# EasyEDA schematic Arduino StandAlone.json
TITLE: Arduino Standalone; REV: 1.0; Date: 2016-11-16; Sheet: 1/1; Drawn By: Wagner Rambo
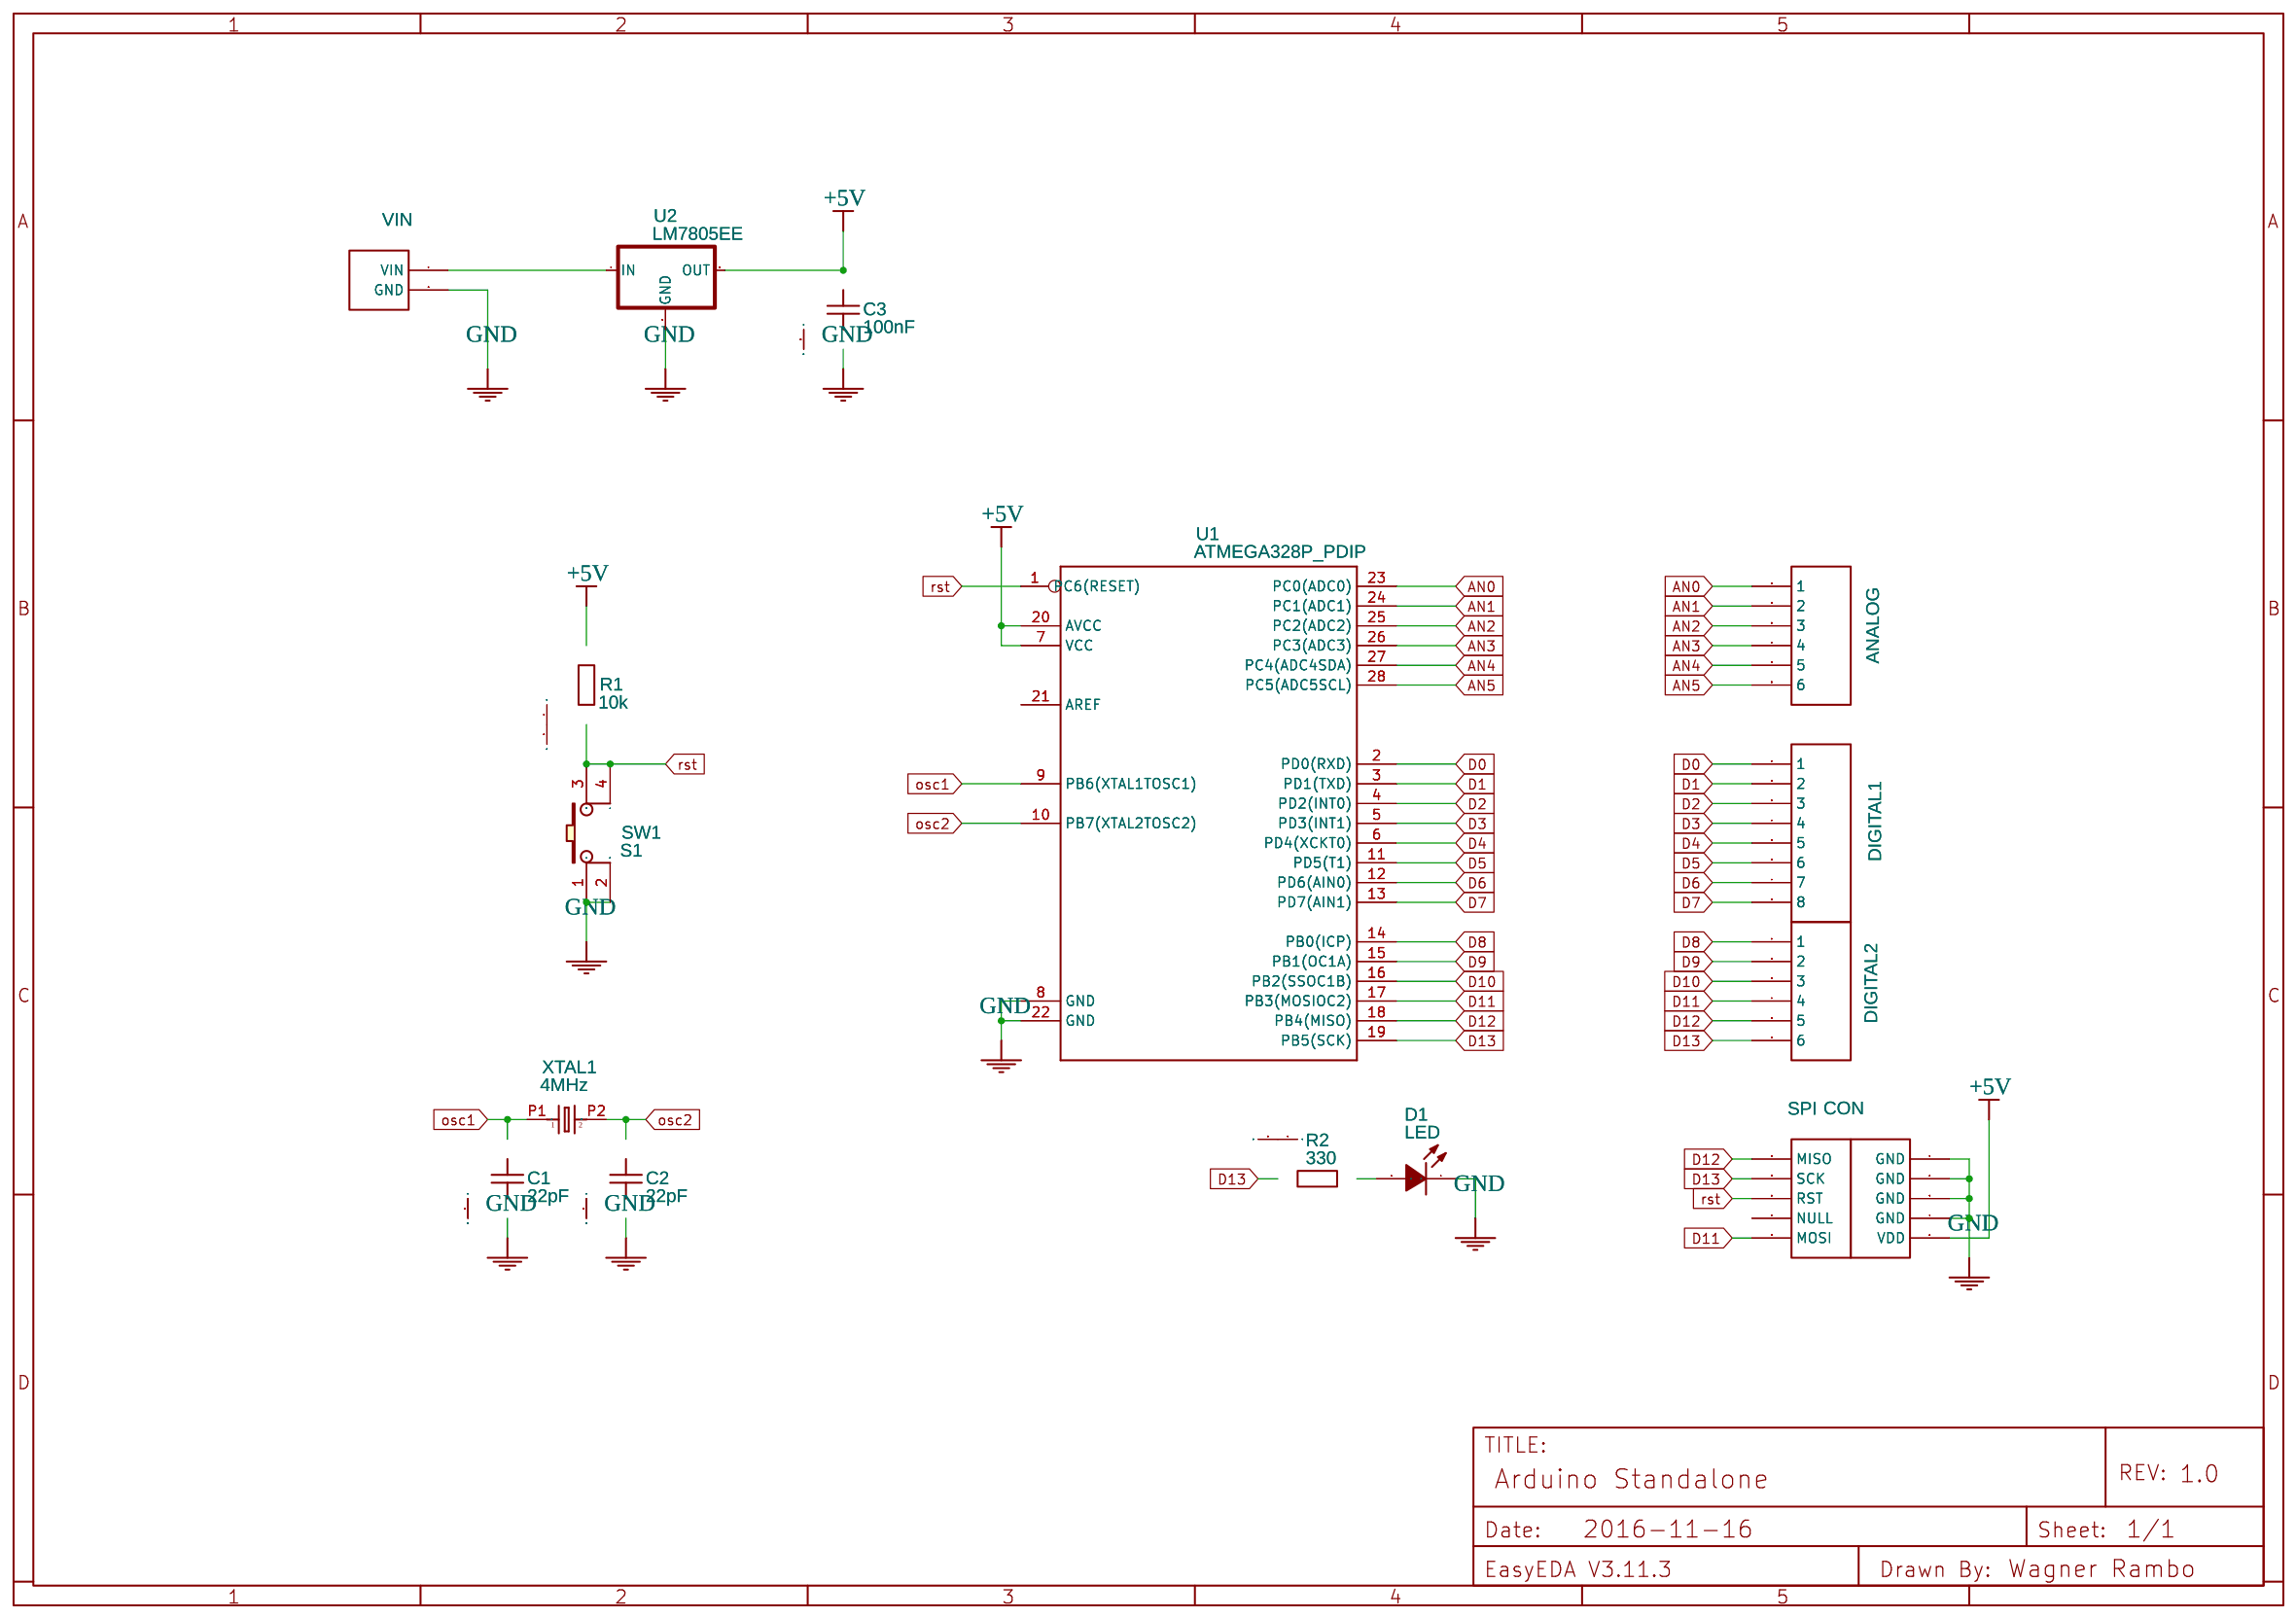
[diagram p0: schematic sheet]

## Parts
ANALOG  SIP6  [HDR1X6]
C1  22pF  [C1]
C2  22pF  [C1]
C3  100nF  [C1]
CON  SIP5  [HDR1X5]
D1  LED  [LED3MM]
DIGITAL1  SIP8  [HDR1X8]
DIGITAL2  SIP6  [HDR1X6]
R1  10k  [R3]
R2  330  [R3]
SPI  SIP5  [HDR1X5]
SW1  S1  [SWITCH-6X6X5_TH]
U1  ATMEGA328P_PDIP  [DIL28-3]
U2  LM7805EE  [TO220]
VIN  SIP2  [HDR1X2]
XTAL1  4MHz  [HC-49U-PTH]

## Library data of the parts
ANALOG CON DIGITAL1 DIGITAL2 SPI VIN = -: catid: 20; Manufacturer Part: ?
C1-C3 = Capacitor: Manufacturer Part: ?
D1 = LED: Manufacturer Part: ?
R1 R2 = Resistor: Manufacturer Part: ?
SW1 = -: Supplier: EasyEDA; Manufacturer: EasyEDA; Manufacturer Part: SWITCH-6x6x5_TH; Supplier Part: E69330
U1 = -: catid: 20; Contributor: SparkFun; Manufacturer Part: ?
U2 = 78XX: catid: 20; Manufacturer Part: ?
XTAL1 = -: catid: 20; Contributor: DangerousPrototype; Manufacturer Part: ?

## Nets
+5V: C3.2 CON.5(VDD) R1.2 U1.7(VCC) U1.20(AVCC) U2.3(OUT)
GND: C1.1 C2.1 C3.1 CON.1(GND) CON.2(GND) CON.3(GND) CON.4(GND) D1.K SW1.1 SW1.2 U1.8(GND) U1.22(GND) U2.2(GND) VIN.2(GND)
AN0: ANALOG.1 U1.23(PC0(ADC0))
AN1: ANALOG.2 U1.24(PC1(ADC1))
AN2: ANALOG.3 U1.25(PC2(ADC2))
AN3: ANALOG.4 U1.26(PC3(ADC3))
AN4: ANALOG.5 U1.27(PC4(ADC4SDA))
AN5: ANALOG.6 U1.28(PC5(ADC5SCL))
D0: DIGITAL1.1 U1.2(PD0(RXD))
D1: DIGITAL1.2 U1.3(PD1(TXD))
D2: DIGITAL1.3 U1.4(PD2(INT0))
D3: DIGITAL1.4 U1.5(PD3(INT1))
D4: DIGITAL1.5 U1.6(PD4(XCKT0))
D5: DIGITAL1.6 U1.11(PD5(T1))
D6: DIGITAL1.7 U1.12(PD6(AIN0))
D7: DIGITAL1.8 U1.13(PD7(AIN1))
D8: DIGITAL2.1 U1.14(PB0(ICP))
D9: DIGITAL2.2 U1.15(PB1(OC1A))
D10: DIGITAL2.3 U1.16(PB2(SSOC1B))
D11: DIGITAL2.4 SPI.5(MOSI) U1.17(PB3(MOSIOC2))
D12: DIGITAL2.5 SPI.1(MISO) U1.18(PB4(MISO))
D13: DIGITAL2.6 R2.1 SPI.2(SCK) U1.19(PB5(SCK))
osc1: C1.2 U1.9(PB6(XTAL1TOSC1)) XTAL1.P1(1)
osc2: C2.2 U1.10(PB7(XTAL2TOSC2)) XTAL1.P2(2)
rst: R1.1 SPI.3(RST) SW1.3 SW1.4 U1.1(PC6(RESET))
Net-(D1-A): D1.A R2.2
Net-(U2-1): U2.1(IN) VIN.1(VIN)

Not connected (* = marked no-connect by the designer): SPI 4(NULL); U1 21(AREF)
